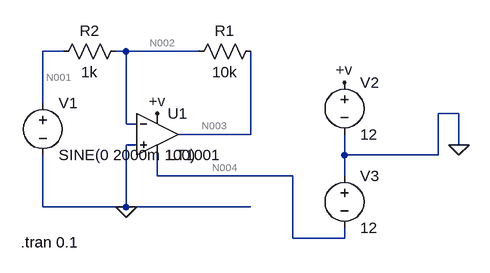
[diagram p0: schematic opamp inverting.asc]
opamp inverting.asc, the LTspice schematic file:
Version 4
SHEET 1 880 680
WIRE 16 48 -16 48
WIRE 112 48 96 48
WIRE 224 48 112 48
WIRE -16 128 -16 48
WIRE 624 144 592 144
WIRE 112 160 112 48
WIRE 128 160 112 160
WIRE 304 176 304 48
WIRE 304 176 192 176
WIRE 128 192 112 192
WIRE 624 192 624 144
WIRE 448 208 448 176
WIRE 592 208 592 144
WIRE 592 208 448 208
WIRE 160 240 160 208
WIRE 368 240 160 240
WIRE 448 240 448 208
WIRE -16 288 -16 208
WIRE 112 288 112 192
WIRE 112 288 -16 288
WIRE 304 288 112 288
WIRE 368 336 368 240
WIRE 448 336 448 320
WIRE 448 336 368 336
FLAG 112 288 0
FLAG 160 144 +v
FLAG 448 96 +v
FLAG 624 192 0
SYMBOL res 320 32 R90
WINDOW 0 0 56 VBottom 2
WINDOW 3 32 56 VTop 2
SYMATTR InstName R1
SYMATTR Value 10k
SYMBOL res 112 32 R90
WINDOW 0 0 56 VBottom 2
WINDOW 3 32 56 VTop 2
SYMATTR InstName R2
SYMATTR Value 1k
SYMBOL Opamps\\LT1001 160 112 R0
SYMATTR InstName U1
SYMBOL voltage -16 112 R0
WINDOW 123 0 0 Left 2
WINDOW 39 0 0 Left 2
SYMATTR InstName V1
SYMATTR Value SINE(0 2000m 100)
SYMBOL voltage 448 80 R0
WINDOW 123 0 0 Left 2
WINDOW 39 0 0 Left 2
SYMATTR InstName V2
SYMATTR Value 12
SYMBOL voltage 448 224 R0
SYMATTR InstName V3
SYMATTR Value 12
TEXT -50 342 Left 2 !.tran 0.1

The netlist it stands for:
* opamp inverting.asc
R1 N003 N002 10k
R2 N002 N001 1k
XU1 0 N002 +v N004 N003 LT1001  ; pins In+ In- V+ V- OUT
V1 N001 0 SINE(0 2000m 100)
V2 +v 0 12
V3 0 N004 12
.tran 0.1
.lib LTC.lib
.backanno
.end

* Results of the author's LTspice run, read from the files saved beside the schematic
* Operating Point, zero values left out:
*   V(+v) = 12 V
*   V(n004) = -12 V
*   I(V3) = -2.25 mA
*   I(V2) = -2.25 mA
*   Ix(u1:3) = 2.25 mA
*   Ix(u1:4) = -2.25 mA
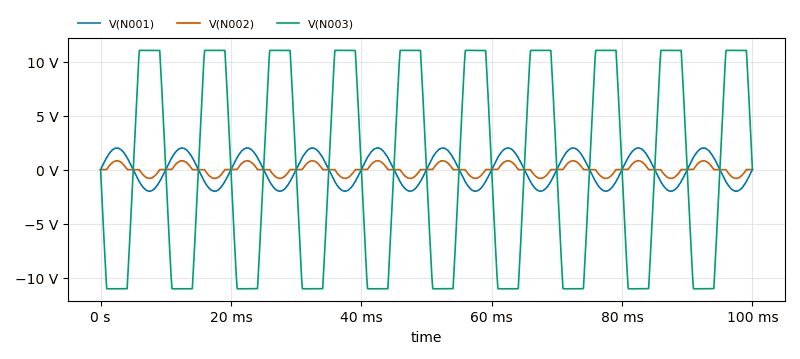
[diagram p1: Transient Analysis of opamp inverting.asc, plotted from the saved traces]
* Transient Analysis, 1 run:
*   V(N001): min -1.998 V, max 1.998 V, average -22.28 µV, rms 1.414 V, last 0 V
*   V(N002): min -813.8 mV, max 813.9 mV, average -4.202 µV, rms 465.2 mV, last 2.355 mV
*   V(N003): min -11.03 V, max 11.03 V, average 176.5 µV, rms 9.621 V, last 25.91 mV